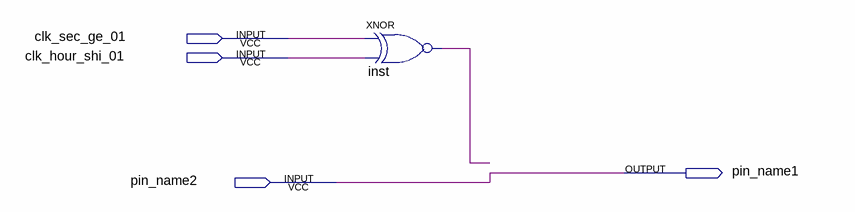
[diagram p0: schematic sheet]
// Quartus schematic test.bdf as structural Verilog: 1 symbols, 4 pins
module test (
  input  clk_sec_ge_01,
  input  clk_hour_shi_01,
  input  pin_name2,
  output pin_name1
);

  wire inst_out;

  xnor inst (inst_out, clk_sec_ge_01, clk_hour_shi_01);

  assign pin_name1 = pin_name2;
endmodule
